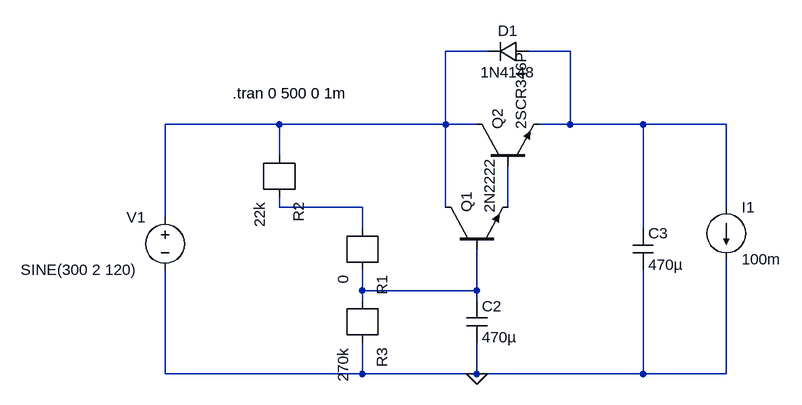
[diagram p0: schematic emitter_follower.asc]
emitter_follower.asc, the LTspice schematic file:
Version 4
SHEET 1 944 680
WIRE 128 -112 64 -112
WIRE 256 -112 192 -112
WIRE -192 0 -368 0
WIRE 64 0 64 -112
WIRE 64 0 -192 0
WIRE 112 0 64 0
WIRE 256 0 256 -112
WIRE 256 0 208 0
WIRE 368 0 256 0
WIRE 496 0 368 0
WIRE -192 48 -192 0
WIRE -192 128 -192 112
WIRE -64 128 -192 128
WIRE 64 128 64 0
WIRE 160 128 160 64
WIRE 496 128 496 0
WIRE -368 144 -368 0
WIRE -64 160 -64 128
WIRE 368 160 368 0
WIRE -64 256 -64 224
WIRE 112 256 112 192
WIRE 112 256 -64 256
WIRE -64 272 -64 256
WIRE 112 272 112 256
WIRE -368 384 -368 224
WIRE -64 384 -64 336
WIRE -64 384 -368 384
WIRE 112 384 112 336
WIRE 112 384 -64 384
WIRE 368 384 368 224
WIRE 368 384 112 384
WIRE 496 384 496 208
WIRE 496 384 368 384
FLAG 112 384 0
SYMBOL npn 64 192 R270
SYMATTR InstName Q1
SYMATTR Value 2N2222
SYMBOL npn 112 64 R270
SYMATTR InstName Q2
SYMATTR Value 2SCR346P
SYMBOL diode 192 -128 R90
WINDOW 0 0 32 VBottom 2
WINDOW 3 32 32 VTop 2
SYMATTR InstName D1
SYMATTR Value 1N4148
SYMBOL r -192 48 R90
SYMATTR InstName R2
SYMATTR Value 22k
SYMBOL r -64 160 R90
SYMATTR InstName R1
SYMATTR Value 0
SYMBOL r -64 272 R90
SYMATTR InstName R3
SYMATTR Value 270k
SYMBOL cap 96 272 R0
SYMATTR InstName C2
SYMATTR Value 470µ
SYMBOL current 496 128 R0
WINDOW 123 0 0 Left 0
WINDOW 39 0 0 Left 0
SYMATTR InstName I1
SYMATTR Value 100m
SYMBOL cap 352 160 R0
SYMATTR InstName C3
SYMATTR Value 470µ
SYMBOL voltage -368 128 R0
WINDOW 0 -59 15 Left 2
WINDOW 3 -222 96 Left 2
WINDOW 123 0 0 Left 0
WINDOW 39 0 0 Left 0
SYMATTR InstName V1
SYMATTR Value SINE(300 2 120)
TEXT -264 -48 Left 2 !.tran 0 500 0 1m

The netlist it stands for:
* emitter_follower.asc
Q1 N001 N005 N004 0 2N2222
Q2 N001 N004 N002 0 2SCR346P
D1 N002 N001 1N4148
R2 N003 N001 22k
R1 N005 N003 0
R3 0 N005 270k
C2 N005 0 470µ
I1 N002 0 100m
C3 N002 0 470µ
V1 N001 0 SINE(300 2 120)
.model D D
.lib standard.dio
.model NPN NPN
.model PNP PNP
.lib standard.bjt
.tran 0 500 0 1m
.backanno
.end